# EAGLE schematic ATMEGA2560 Board (EAGLE 9.6.2)
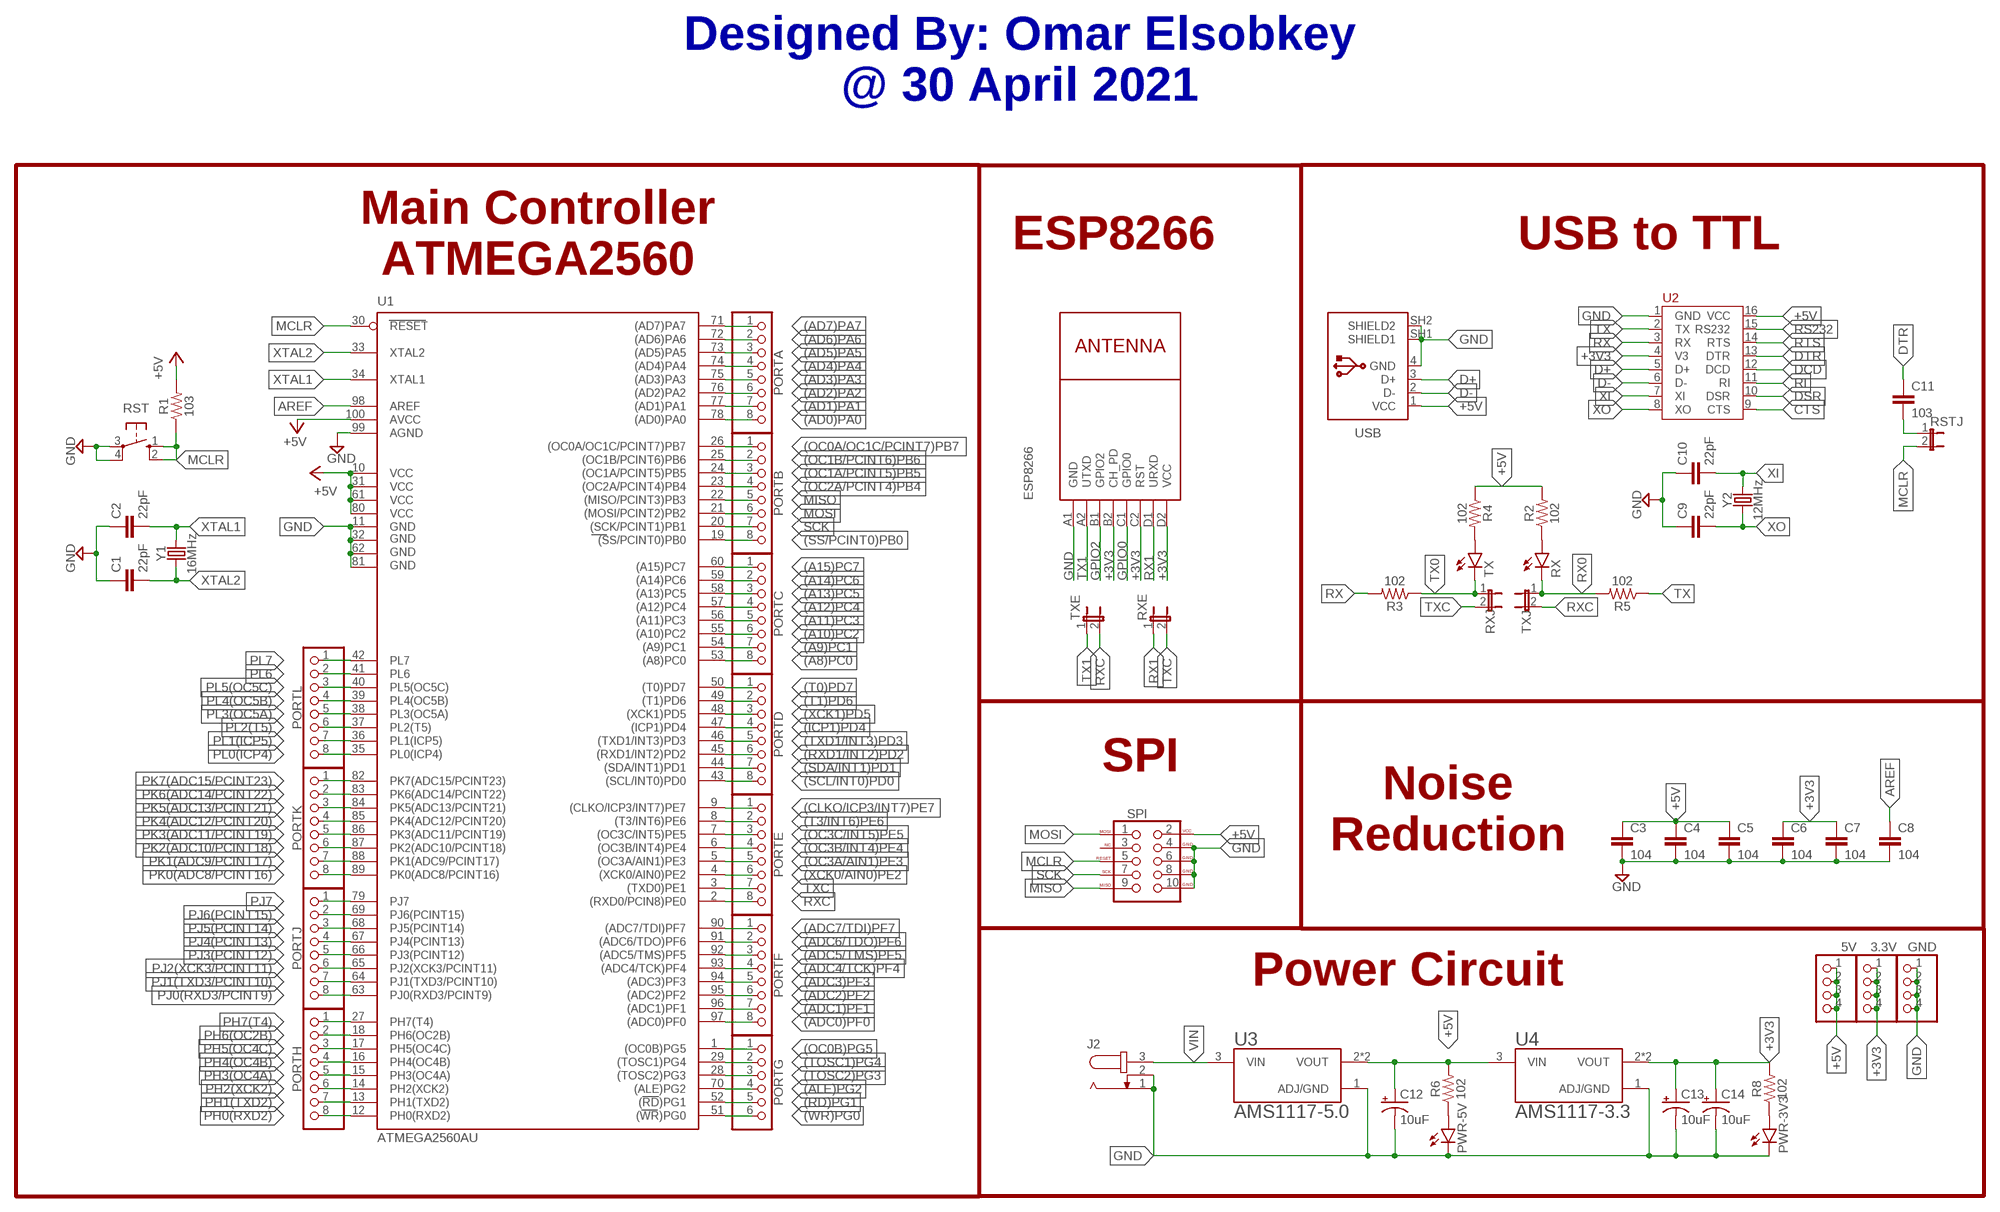
[diagram p0: schematic, sheet 1]

## Parts
3.3V  PINHD-1X4  [1X04]
5V  PINHD-1X4  [1X04]
C1  22pF  22PF-PTH-2.54MM-200V-5%  [CAP-PTH-2.54]
C2  22pF  22PF-PTH-2.54MM-200V-5%  [CAP-PTH-2.54]
C3  104  22PF-PTH-2.54MM-200V-5%  [CAP-PTH-2.54]
C4  104  22PF-PTH-2.54MM-200V-5%  [CAP-PTH-2.54]
C5  104  22PF-PTH-2.54MM-200V-5%  [CAP-PTH-2.54]
C6  104  22PF-PTH-2.54MM-200V-5%  [CAP-PTH-2.54]
C7  104  22PF-PTH-2.54MM-200V-5%  [CAP-PTH-2.54]
C8  104  22PF-PTH-2.54MM-200V-5%  [CAP-PTH-2.54]
C9  22pF  22PF-PTH-2.54MM-200V-5%  [CAP-PTH-2.54]
C10  22pF  22PF-PTH-2.54MM-200V-5%  [CAP-PTH-2.54]
C11  103  22PF-PTH-2.54MM-200V-5%  [CAP-PTH-2.54]
C12  10uF  10UF-POLAR-RADIAL-2.5MM-KIT-25V-20%  [CPOL-RADIAL-2.5MM-5MM-KIT]
C13  10uF  10UF-POLAR-RADIAL-2.5MM-KIT-25V-20%  [CPOL-RADIAL-2.5MM-5MM-KIT]
C14  10uF  10UF-POLAR-RADIAL-2.5MM-KIT-25V-20%  [CPOL-RADIAL-2.5MM-5MM-KIT]
ESP8266  WIRELESS-WIFI-ESP-01  [WIRELESS-WIFI-ESP-01]
GND  PINHD-1X4  [1X04]
J2  JACK-PLUG0  [SPC4077]
PORTA  PINHD-1X8  [1X08]
PORTB  PINHD-1X8  [1X08]
PORTC  PINHD-1X8  [1X08]
PORTD  PINHD-1X8  [1X08]
PORTE  PINHD-1X8  [1X08]
PORTF  PINHD-1X8  [1X08]
PORTG  PINHD-1X6  [1X06]
PORTH  PINHD-1X8  [1X08]
PORTJ  PINHD-1X8  [1X08]
PORTK  PINHD-1X8  [1X08]
PORTL  PINHD-1X8  [1X08]
PWR-3V3  LEDCHIP-LED0805  [CHIP-LED0805]
PWR-5V  LEDCHIP-LED0805  [CHIP-LED0805]
R1  103  RESISTOR1206  [1206]
R2  102  RESISTOR1206  [1206]
R3  102  RESISTOR1206  [1206]
R4  102  RESISTOR1206  [1206]
R5  102  RESISTOR1206  [1206]
R6  102  RESISTOR1206  [1206]
R8  102  RESISTOR1206  [1206]
RST  10-XX  [B3F-10XX]
RSTJ  JP1E  [JP1]
RX  LEDCHIP-LED0805  [CHIP-LED0805]
RXE  JP1E  [JP1]
RXJ  JP1E  [JP1]
SPI  AVR_SPI_PROG_5X2LOCK  [2X5-SHROUDED_LOCK]
TX  LEDCHIP-LED0805  [CHIP-LED0805]
TXE  JP1E  [JP1]
TXJ  JP1E  [JP1]
U1  ATMEGA2560AU  [TQFP100]
U2  CH340G  [SOP-16]
U3  AMS1117-5.0  [AMS1117-5.0]
U4  AMS1117-3.3  AMS1117-5.0  [AMS1117-5.0]
USB  61729-1011  [61729-1011BLF]
Y1  16MHz  CRYSTALPTH-HC49UV  [HC49U]
Y2  12MHz  CRYSTALPTH-HC49UV  [HC49U]

## Nets
(A8)PC0: PORTC.8 U1.53((A8)PC0)
(A9)PC1: PORTC.7 U1.54((A9)PC1)
(A10)PC2: PORTC.6 U1.55((A10)PC2)
(A11)PC3: PORTC.5 U1.56((A11)PC3)
(A12)PC4: PORTC.4 U1.57((A12)PC4)
(A13)PC5: PORTC.3 U1.58((A13)PC5)
(A14)PC6: PORTC.2 U1.59((A14)PC6)
(A15)PC7: PORTC.1 U1.60((A15)PC7)
(AD0)PA0: PORTA.8 U1.78((AD0)PA0)
(AD1)PA1: PORTA.7 U1.77((AD1)PA1)
(AD2)PA2: PORTA.6 U1.76((AD2)PA2)
(AD3)PA3: PORTA.5 U1.75((AD3)PA3)
(AD4)PA4: PORTA.4 U1.74((AD4)PA4)
(AD5)PA5: PORTA.3 U1.73((AD5)PA5)
(AD6)PA6: PORTA.2 U1.72((AD6)PA6)
(AD7)PA7: PORTA.1 U1.71((AD7)PA7)
(ADC0)PF0: PORTF.8 U1.97((ADC0)PF0)
(ADC1)PF1: PORTF.7 U1.96((ADC1)PF1)
(ADC2)PF2: PORTF.6 U1.95((ADC2)PF2)
(ADC3)PF3: PORTF.5 U1.94((ADC3)PF3)
(ADC4/TCK)PF4: PORTF.4 U1.93((ADC4/TCK)PF4)
(ADC5/TMS)PF5: PORTF.3 U1.92((ADC5/TMS)PF5)
(ADC6/TDO)PF6: PORTF.2 U1.91((ADC6/TDO)PF6)
(ADC7/TDI)PF7: PORTF.1 U1.90((ADC7/TDI)PF7)
(ALE)PG2: PORTG.4 U1.70((ALE)PG2)
(CLKO/ICP3/INT7)PE7: PORTE.1 U1.9((CLKO/ICP3/INT7)PE7)
(ICP1)PD4: PORTD.4 U1.47((ICP1)PD4)
(OC0A/OC1C/PCINT7)PB7: PORTB.1 U1.26((OC0A/OC1C/PCINT7)PB7)
(OC0B)PG5: PORTG.1 U1.1((OC0B)PG5)
(OC1A/PCINT5)PB5: PORTB.3 U1.24((OC1A/PCINT5)PB5)
(OC1B/PCINT6)PB6: PORTB.2 U1.25((OC1B/PCINT6)PB6)
(OC2A/PCINT4)PB4: PORTB.4 U1.23((OC2A/PCINT4)PB4)
(OC3A/AIN1)PE3: PORTE.5 U1.5((OC3A/AIN1)PE3)
(OC3B/INT4)PE4: PORTE.4 U1.6((OC3B/INT4)PE4)
(OC3C/INT5)PE5: PORTE.3 U1.7((OC3C/INT5)PE5)
(RD)PG1: PORTG.5 U1.52((RD)PG1)
(RXD1/INT2)PD2: PORTD.6 U1.45((RXD1/INT2)PD2)
(SCL/INT0)PD0: PORTD.8 U1.43((SCL/INT0)PD0)
(SDA/INT1)PD1: PORTD.7 U1.44((SDA/INT1)PD1)
(SS/PCINT0)PB0: PORTB.8 U1.19((SS/PCINT0)PB0)
(T0)PD7: PORTD.1 U1.50((T0)PD7)
(T1)PD6: PORTD.2 U1.49((T1)PD6)
(T3/INT6)PE6: PORTE.2 U1.8((T3/INT6)PE6)
(TOSC1)PG4: PORTG.2 U1.29((TOSC1)PG4)
(TOSC2)PG3: PORTG.3 U1.28((TOSC2)PG3)
(TXD1/INT3)PD3: PORTD.5 U1.46((TXD1/INT3)PD3)
(WR)PG0: PORTG.6 U1.51((WR)PG0)
(XCK0/AIN0)PE2: PORTE.6 U1.4((XCK0/AIN0)PE2)
(XCK1)PD5: PORTD.3 U1.48((XCK1)PD5)
+3V3: 3.3V.1 3.3V.2 3.3V.3 3.3V.4 C6.1 C7.1 C13.1(+) C14.1(+) ESP8266.B2(CH_PD) ESP8266.C2(RST) ESP8266.D2(VCC) R8.2 U2.4(V3) U4.2(VOUT) U4.4(VOUT)
+5V: 5V.1 5V.2 5V.3 5V.4 C3.1 C4.1 C5.1 C12.1(+) R1.2 R2.2 R4.1 R6.2 SPI.2(VCC) U1.10(VCC) U1.31(VCC1) U1.61(VCC2) U1.80(VCC3) U1.100(AVCC) U2.16(VCC) U3.2(VOUT) U3.4(VOUT) U4.3(VIN) USB.1(VCC)
AREF: C8.1 U1.98(AREF)
CTS: U2.9(CTS)
D+: U2.5(D+) USB.3(D+)
D-: U2.6(D-) USB.2(D-)
DCD: U2.12(DCD)
DSR: U2.10(DSR)
DTR: C11.1 U2.13(DTR)
GND: C1.1 C2.1 C3.2 C4.2 C5.2 C6.2 C7.2 C8.2 C9.1 C10.1 C12.2(-) C13.2(-) C14.2(-) ESP8266.A1(GND) GND.1 GND.2 GND.3 GND.4 J2.1 J2.2 PWR-3V3.C PWR-5V.C RST.3(P) RST.4(P1) SPI.4(GND) SPI.6(GND) SPI.8(GND) SPI.10(GND) U1.11(GND) U1.32(GND1) U1.62(GND2) U1.81(GND3) U1.99(AGND) U2.1(GND) U3.1(ADJ/GND) U4.1(ADJ/GND) USB.4(GND) USB.SH1(SHIELD1) USB.SH2(SHIELD2)
GPIO0: ESP8266.C1(GPIO0)
GPIO2: ESP8266.B1(GPIO2)
MCLR: R1.1 RST.1(S) RST.2(S1) RSTJ.2 SPI.5(RESET) U1.30(RESET)
MISO: PORTB.5 SPI.9(MISO) U1.22((MISO/PCINT3)PB3)
MOSI: PORTB.6 SPI.1(MOSI) U1.21((MOSI/PCINT2)PB2)
N$1: R2.1 RX.A
N$2: R4.2 TX.A
N$3: PWR-5V.A R6.1
N$6: PWR-3V3.A R8.1
N$100: C11.2 RSTJ.1
PH0(RXD2): PORTH.8 U1.12(PH0(RXD2))
PH1(TXD2): PORTH.7 U1.13(PH1(TXD2))
PH2(XCK2): PORTH.6 U1.14(PH2(XCK2))
PH3(OC4A): PORTH.5 U1.15(PH3(OC4A))
PH4(OC4B): PORTH.4 U1.16(PH4(OC4B))
PH5(OC4C): PORTH.3 U1.17(PH5(OC4C))
PH6(OC2B): PORTH.2 U1.18(PH6(OC2B))
PH7(T4): PORTH.1 U1.27(PH7(T4))
PJ0(RXD3/PCINT9): PORTJ.8 U1.63(PJ0(RXD3/PCINT9))
PJ1(TXD3/PCINT10): PORTJ.7 U1.64(PJ1(TXD3/PCINT10))
PJ2(XCK3/PCINT11): PORTJ.6 U1.65(PJ2(XCK3/PCINT11))
PJ3(PCINT12): PORTJ.5 U1.66(PJ3(PCINT12))
PJ4(PCINT13): PORTJ.4 U1.67(PJ4(PCINT13))
PJ5(PCINT14): PORTJ.3 U1.68(PJ5(PCINT14))
PJ6(PCINT15): PORTJ.2 U1.69(PJ6(PCINT15))
PJ7: PORTJ.1 U1.79(PJ7)
PK0(ADC8/PCINT16): PORTK.8 U1.89(PK0(ADC8/PCINT16))
PK1(ADC9/PCINT17): PORTK.7 U1.88(PK1(ADC9/PCINT17))
PK2(ADC10/PCINT18): PORTK.6 U1.87(PK2(ADC10/PCINT18))
PK3(ADC11/PCINT19): PORTK.5 U1.86(PK3(ADC11/PCINT19))
PK4(ADC12/PCINT20): PORTK.4 U1.85(PK4(ADC12/PCINT20))
PK5(ADC13/PCINT21): PORTK.3 U1.84(PK5(ADC13/PCINT21))
PK6(ADC14/PCINT22): PORTK.2 U1.83(PK6(ADC14/PCINT22))
PK7(ADC15/PCINT23): PORTK.1 U1.82(PK7(ADC15/PCINT23))
PL0(ICP4): PORTL.8 U1.35(PL0(ICP4))
PL1(ICP5): PORTL.7 U1.36(PL1(ICP5))
PL2(T5): PORTL.6 U1.37(PL2(T5))
PL3(OC5A): PORTL.5 U1.38(PL3(OC5A))
PL4(OC5B): PORTL.4 U1.39(PL4(OC5B))
PL5(OC5C): PORTL.3 U1.40(PL5(OC5C))
PL6: PORTL.2 U1.41(PL6)
PL7: PORTL.1 U1.42(PL7)
RI: U2.11(RI)
RS232: U2.15(RS232)
RTS: U2.14(RTS)
RX: R3.2 U2.3(RX)
RX0: R5.2 RX.C TXJ.1
RX1: ESP8266.D1(URXD) RXE.1
RXC: PORTE.8 TXE.2 TXJ.2 U1.2((RXD0/PCIN8)PE0)
SCK: PORTB.7 SPI.7(SCK) U1.20((SCK/PCINT1)PB1)
TX: R5.1 U2.2(TX)
TX0: R3.1 RXJ.1 TX.C
TX1: ESP8266.A2(UTXD) TXE.1
TXC: PORTE.7 RXE.2 RXJ.2 U1.3((TXD0)PE1)
VIN: J2.3 U3.3(VIN)
XI: C10.2 U2.7(XI) Y2.2
XO: C9.2 U2.8(XO) Y2.1
XTAL1: C2.2 U1.34(XTAL1) Y1.2
XTAL2: C1.2 U1.33(XTAL2) Y1.1
Unconnected: SPI.3(NC)

## Notes on the sheet
- Designed By: Omar Elsobkey
  @ 30 April 2021
- Main Controller
  ATMEGA2560
- ESP8266 | USB to TTL
- SPI
- Noise
  Reduction
- Power Circuit

## Library data of the parts
3.3V 5V GND = pinhead:PINHD-1X4: PIN HEADER
C1 C2 C9 C10 = SparkFun-Capacitors:22PF: 22pF ceramic capacitors A capacitor is a passive two-terminal electrical component used to store electrical energy temporarily in an electric field.; PROD_ID: CAP-09128
C3-C8 C11 = SparkFun-Capacitors:22PF: 22pF ceramic capacitors A capacitor is a passive two-terminal electrical component used to store electrical energy temporarily in an electric field.; PROD_ID: CAP-09128; VALUE: 22pF
C12-C14 = SparkFun-Capacitors:10UF-POLAR: 10.0µF polarized capacitors A capacitor is a passive two-terminal electrical component used to store electrical energy temporarily in an electric field.; PROD_ID: CAP-08440
ESP8266 = Modules:WIRELESS-WIFI-ESP-01: Wireless Wi-Fi ESP-01 Module based on ESP8266 chip Click here to find device on ebay.com <http://www.ebay.com/sch/esp8266+esp+01+transceiver>
J2 = con-jack:JACK-PLUG: DC POWER JACK Power Jack, DC, Right Angle, Through Hole, Rated 5A at 16VDC, PC Terminals Distributor: Farnell (www.Farnell.de) Drawing: 84N1161.pdf / 84N1162.pdf Manufacturer: SPC Technology (www.spctechnology.com) Type: SPC4077 / SPC 4078; OC_FARNELL: unknown; OC_NEWARK: unknown
PORTA PORTB PORTC PORTD PORTE PORTF PORTH PORTJ PORTK PORTL = pinhead:PINHD-1X8: PIN HEADER
PORTG = pinhead:PINHD-1X6: PIN HEADER
PWR-3V3 PWR-5V RX TX = led:LED: LED OSRAM: - CHIPLED LG R971, LG N971, LY N971, LG Q971, LY Q971, LO R971, LY R971 LH N974, LH R974 LS Q976, LO Q976, LY Q976 LO Q996 - Hyper CHIPLED LW Q18S LB Q993, LB Q99A, LB R99A - SideLED LS A670, LO A670, LY A670, LG A670, LP A670 LB A673, LV A673, LT A673, LW A673 LH A674 LY A675 LS A676, LA A676, LO A676, LY A676, LW A676 LS A679, LY A679, LG A679 - Hyper Micro SIDELED® LS Y876, LA Y876, LO Y876, LY Y876 LT Y87S - SmartLED LW L88C, LW L88S LB L89C, LB L89S, LG L890 LS L89K, LO L89K, LY L89K LS L896, LA L896, LO L896, LY L896 - TOPLED LS T670, LO T670, LY T670, LG T670, LP T670 LSG T670, LSP T670, LSY T670, LOP T670, LYG T670 LG T671, LOG T671, LSG T671 LB T673, LV T673, LT T673, LW T673 LH T674 LS T676, LA T676, LO T676, LY T676, LB T676, LH T676, LSB T676, LW T676 LB T67C, LV T67C, LT T67C, LS T67K, LO T67K, LY T67K, LW E67C LS E67B, LA E67B, LO E67B, LY E67B, LB E67C, LV E67C, LT E67C LW T67C LS T679, LY T679, LG T679 LS T770, LO T770, LY T770, LG T770, LP T770 LB T773, LV T773, LT T773, LW T773 LH T774 LS E675, LA E675, LY E675, LS T675 LS T776, LA T776, LO T776, LY T776, LB T776 LHGB T686 LT T68C, LB T68C - Hyper Mini TOPLED® LB M676 - Mini TOPLED Santana® LG M470 LS M47K, LO M47K, LY M47K Source: http://www.osram.convergy.de LUXEON: - LUMILED® LXK2-PW12-R00, LXK2-PW12-S00, LXK2-PW14-U00, LXK2-PW14-V00 LXK2-PM12-R00, LXK2-PM12-S00, LXK2-PM14-U00 LXK2-PE12-Q00, LXK2-PE12-R00, LXK2-PE12-S00, LXK2-PE14-T00, LXK2-PE14-U00 LXK2-PB12-K00, LXK2-PB12-L00, LXK2-PB12-M00, LXK2-PB14-N00, LXK2-PB14-P00, LXK2-PB14-Q00 LXK2-PR12-L00, LXK2-PR12-M00, LXK2-PR14-Q00, LXK2-PR14-R00 LXK2-PD12-Q00, LXK2-PD12-R00, LXK2-PD12-S00 LXK2-PH12-R00, LXK2-PH12-S00 LXK2-PL12-P00, LXK2-PL12-Q00, LXK2-PL12-R00 Source: www.luxeon.com KINGBRIGHT: KA-3528ASYC Source: www.kingbright.com
R1-R6 R8 = SparkFun-Resistors:RESISTOR: Generic Resistor Package
RST = switch-omron:10-XX: OMRON SWITCH; MPN: B3F-1000; OC_FARNELL: 176432; OC_NEWARK: 36M3542
RSTJ RXE RXJ TXE TXJ = jumper:JP1E: JUMPER
SPI = SparkFun-Connectors:AVR_SPI_PROG_5X2: AVR 10-pin ICSP Header This is the standard AVR In Circuit Serial Programming header. Minimal, but includes pin one indicator. Works with standard Olimex programmers. SparkFun Products: 2x5 AVR ICSP Male Header <https://www.sparkfun.com/products/778> - PTH 2x5 Pin Shrouded Header <https://www.sparkfun.com/products/8506> - PTH2; PROD_ID: CONN-08671; SF_ID: PRT-08506
U1 = SparkFun-IC-Microcontroller:ATMEGA2560: Atmel 100-pin 8-bit uC 64/128/256 Kbytes FLASH 4 Kbytes EEPROM 8 Kbytes SRAM 86 General Purpose I/O pins 12-channels16-bit PWM 4 x Serial USARTs 16-channels 10-bit A/D SparkFun Products None.; PROD_ID: IC-10040
U2 = CH340G:CH340G
U3 U4 = AMS1117-5.0:AMS1117-5.0: Sot223/Pkg 1-Amp 5-Volt Low Drop Out Voltage Regulatator; AVAILABILITY: Unavailable; DESCRIPTION: Sot223/Pkg 1-Amp 5-Volt Low Drop Out Voltage Regulatator; MF: Advanced Monolithic Systems; MP: AMS1117-5.0; PACKAGE: None; PRICE: None
USB = Connector_USB:61729-1011: USB(2.0) Type-B, RCPT, 4POS, THT-R/A Datasheet <https://www.amphenol-icc.com/media/wysiwyg/files/drawing/61729.pdf>; CATEGORY: Connector; CONTACTS: 4; CURRENT_RATING: 1A; DESCRIPTION: CONN RCPT USB2.0 TYPEB 4POS R/A; GENDER: Receptacle; MANUFACTURER: Amphenol ICC (FCI); MOUNT_TYPE: R/A; MPN: 61729-1011BLF; OPERATING_TEMP: -55°C to 85°C; PART_STATUS: Active; ROHS_COMPLIANT: RoHS Compliant; SERIES: 61729; SUB-CATEGORY: USB; TYPE: USB-B
Y1 Y2 = SparkFun-Clocks:CRYSTAL: Crystals (Generic) These are passive quartz crystals, which can be used as a clock source for a microcontroller. Crystal's are two-terminal devices. They require external "load" capacitors to generate an oscillating signal.